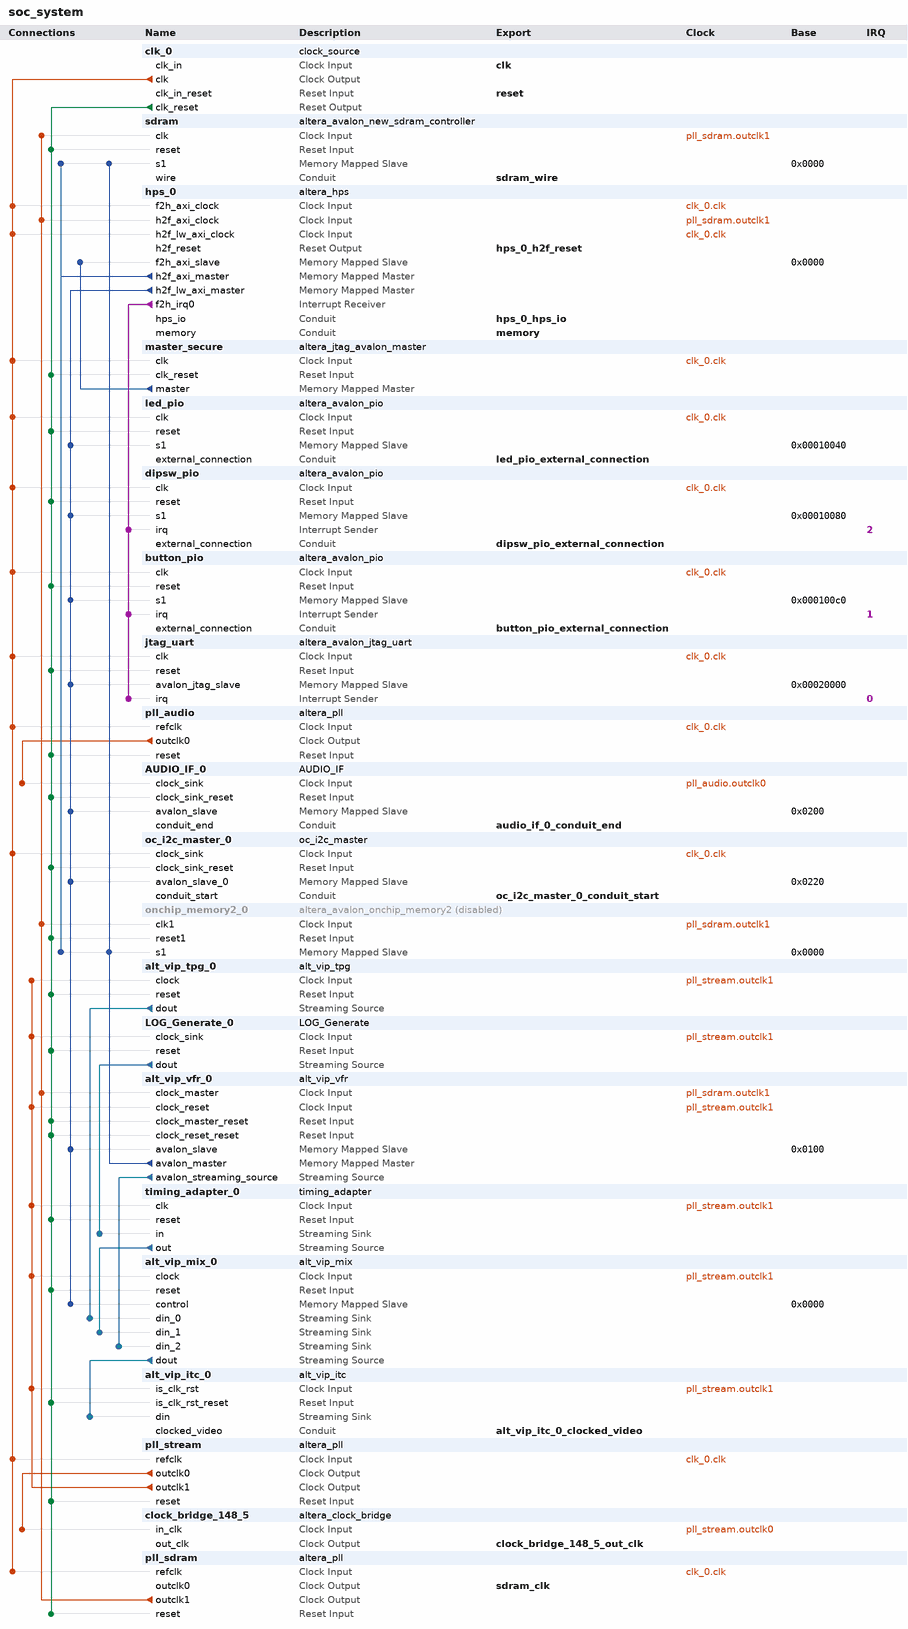
[diagram p0: system contents]
# Platform Designer (Qsys) system soc_system, Cyclone V 5CSXFC6D6F31C8ES
# Parameters at their usual value, and those the tool derives, are not listed.
package require -exact qsys 13.0
create_system soc_system
set_project_property DEVICE_FAMILY {Cyclone V}
set_project_property DEVICE 5CSXFC6D6F31C8ES

add_instance clk_0 clock_source 13.0
set_instance_parameter_value clk_0 clockFrequency 50000000

add_instance sdram altera_avalon_new_sdram_controller 13.0.1.99.2
set_instance_parameter_value sdram TAC 5.5
set_instance_parameter_value sdram TRCD 20.0
set_instance_parameter_value sdram TRP 20.0
set_instance_parameter_value sdram casLatency 3
set_instance_parameter_value sdram columnWidth 10
set_instance_parameter_value sdram dataWidth 16
set_instance_parameter_value sdram generateSimulationModel false
set_instance_parameter_value sdram model single_Micron_MT48LC4M32B2_7_chip
set_instance_parameter_value sdram numberOfBanks 4
set_instance_parameter_value sdram numberOfChipSelects 1
set_instance_parameter_value sdram powerUpDelay 100.0
set_instance_parameter_value sdram refreshPeriod 15.625
set_instance_parameter_value sdram rowWidth 13

add_instance hps_0 altera_hps 13.0.1
set_instance_parameter_value hps_0 MEM_VENDOR JEDEC
set_instance_parameter_value hps_0 MEM_ROW_ADDR_WIDTH 15
set_instance_parameter_value hps_0 MEM_COL_ADDR_WIDTH 10
set_instance_parameter_value hps_0 MEM_DQ_WIDTH 32
set_instance_parameter_value hps_0 MEM_BANKADDR_WIDTH 3
set_instance_parameter_value hps_0 MEM_DRV_STR RZQ/7
set_instance_parameter_value hps_0 MEM_RTT_NOM RZQ/4
set_instance_parameter_value hps_0 MEM_RTT_WR RZQ/4
set_instance_parameter_value hps_0 MEM_WTCL 8
set_instance_parameter_value hps_0 MEM_TCL 11
set_instance_parameter_value hps_0 TIMING_TIS 180
set_instance_parameter_value hps_0 TIMING_TIH 140
set_instance_parameter_value hps_0 TIMING_TDS 30
set_instance_parameter_value hps_0 TIMING_TDH 65
set_instance_parameter_value hps_0 TIMING_TDQSQ 125
set_instance_parameter_value hps_0 TIMING_TDQSCK 255
set_instance_parameter_value hps_0 TIMING_TQSH 0.4
set_instance_parameter_value hps_0 MEM_TRAS_NS 35.0
set_instance_parameter_value hps_0 MEM_TRCD_NS 13.75
set_instance_parameter_value hps_0 MEM_TRP_NS 13.75
set_instance_parameter_value hps_0 MEM_TRFC_NS 260.0
set_instance_parameter_value hps_0 MEM_TFAW_NS 30.0
set_instance_parameter_value hps_0 REF_CLK_FREQ 25.0
set_instance_parameter_value hps_0 DEFAULT_FAST_SIM_MODEL true
set_instance_parameter_value hps_0 TIMING_BOARD_MAX_CK_DELAY 0.03
set_instance_parameter_value hps_0 TIMING_BOARD_MAX_DQS_DELAY 0.02
set_instance_parameter_value hps_0 TIMING_BOARD_SKEW_CKDQS_DIMM_MIN 0.09
set_instance_parameter_value hps_0 TIMING_BOARD_SKEW_CKDQS_DIMM_MAX 0.16
set_instance_parameter_value hps_0 TIMING_BOARD_SKEW_WITHIN_DQS 0.01
set_instance_parameter_value hps_0 TIMING_BOARD_SKEW_BETWEEN_DQS 0.08
set_instance_parameter_value hps_0 TIMING_BOARD_DQ_TO_DQS_SKEW 0.0
set_instance_parameter_value hps_0 TIMING_BOARD_AC_SKEW 0.03
set_instance_parameter_value hps_0 TIMING_BOARD_AC_TO_CK_SKEW 0.0
set_instance_parameter_value hps_0 MEM_CLK_FREQ 400.0
set_instance_parameter_value hps_0 HPS_PROTOCOL DDR3
set_instance_parameter_value hps_0 STM_Enable false
set_instance_parameter_value hps_0 F2S_Width 2
set_instance_parameter_value hps_0 S2F_Width 3
set_instance_parameter_value hps_0 LWH2F_Enable true
set_instance_parameter_value hps_0 F2SCLK_DBGRST_Enable false
set_instance_parameter_value hps_0 F2SCLK_WARMRST_Enable false
set_instance_parameter_value hps_0 F2SCLK_COLDRST_Enable false
set_instance_parameter_value hps_0 F2SINTERRUPT_Enable true
set_instance_parameter_value hps_0 EMAC1_PinMuxing {HPS I/O Set 0}
set_instance_parameter_value hps_0 EMAC1_Mode RGMII
set_instance_parameter_value hps_0 QSPI_PinMuxing {HPS I/O Set 0}
set_instance_parameter_value hps_0 QSPI_Mode {1 SS}
set_instance_parameter_value hps_0 SDIO_PinMuxing {HPS I/O Set 0}
set_instance_parameter_value hps_0 SDIO_Mode {4-bit Data}
set_instance_parameter_value hps_0 USB1_PinMuxing {HPS I/O Set 0}
set_instance_parameter_value hps_0 USB1_Mode SDR
set_instance_parameter_value hps_0 SPIM1_PinMuxing {HPS I/O Set 0}
set_instance_parameter_value hps_0 SPIM1_Mode {Single Slave Select}
set_instance_parameter_value hps_0 UART0_PinMuxing {HPS I/O Set 0}
set_instance_parameter_value hps_0 UART0_Mode {No Flow Control}
set_instance_parameter_value hps_0 I2C0_PinMuxing {HPS I/O Set 0}
set_instance_parameter_value hps_0 I2C0_Mode I2C
set_instance_parameter_value hps_0 I2C1_PinMuxing {HPS I/O Set 0}
set_instance_parameter_value hps_0 I2C1_Mode I2C
set_instance_parameter_value hps_0 S2FCLK_USER1CLK_FREQ 100
set_instance_parameter_value hps_0 FPGA_PERIPHERAL_OUTPUT_CLOCK_FREQ_EMAC0_MD_CLK 100
set_instance_parameter_value hps_0 FPGA_PERIPHERAL_OUTPUT_CLOCK_FREQ_EMAC0_GTX_CLK 100
set_instance_parameter_value hps_0 FPGA_PERIPHERAL_OUTPUT_CLOCK_FREQ_EMAC1_MD_CLK 100
set_instance_parameter_value hps_0 FPGA_PERIPHERAL_OUTPUT_CLOCK_FREQ_EMAC1_GTX_CLK 100
set_instance_parameter_value hps_0 quartus_ini_hps_ip_enable_loanio false

add_instance master_secure altera_jtag_avalon_master 13.0

add_instance led_pio altera_avalon_pio 13.0.1.99.2
set_instance_parameter_value led_pio direction Output
set_instance_parameter_value led_pio resetValue 15
set_instance_parameter_value led_pio width 10

add_instance dipsw_pio altera_avalon_pio 13.0.1.99.2
set_instance_parameter_value dipsw_pio bitClearingEdgeCapReg true
set_instance_parameter_value dipsw_pio captureEdge true
set_instance_parameter_value dipsw_pio direction Input
set_instance_parameter_value dipsw_pio edgeType ANY
set_instance_parameter_value dipsw_pio generateIRQ true
set_instance_parameter_value dipsw_pio irqType EDGE
set_instance_parameter_value dipsw_pio width 4

add_instance button_pio altera_avalon_pio 13.0.1.99.2
set_instance_parameter_value button_pio bitClearingEdgeCapReg true
set_instance_parameter_value button_pio captureEdge true
set_instance_parameter_value button_pio direction Input
set_instance_parameter_value button_pio edgeType FALLING
set_instance_parameter_value button_pio generateIRQ true
set_instance_parameter_value button_pio irqType EDGE
set_instance_parameter_value button_pio width 2

add_instance jtag_uart altera_avalon_jtag_uart 13.0.1.99.2
set_instance_parameter_value jtag_uart allowMultipleConnections true
set_instance_parameter_value jtag_uart simInteractiveOptions INTERACTIVE_ASCII_OUTPUT

add_instance pll_audio altera_pll 13.0
set_instance_parameter_value pll_audio gui_device_speed_grade 8
set_instance_parameter_value pll_audio gui_pll_mode {Fractional-N PLL}
set_instance_parameter_value pll_audio gui_reference_clock_frequency 50.0
set_instance_parameter_value pll_audio gui_operation_mode normal
set_instance_parameter_value pll_audio gui_use_locked true
set_instance_parameter_value pll_audio gui_number_of_clocks 1
set_instance_parameter_value pll_audio gui_output_clock_frequency0 18.431999

add_instance AUDIO_IF_0 AUDIO_IF 1.0

add_instance oc_i2c_master_0 oc_i2c_master 1.0

add_instance onchip_memory2_0 altera_avalon_onchip_memory2 13.0.1.99.2
set_instance_property onchip_memory2_0 ENABLED false
set_instance_parameter_value onchip_memory2_0 dataWidth 32
set_instance_parameter_value onchip_memory2_0 dualPort false
set_instance_parameter_value onchip_memory2_0 initMemContent true
set_instance_parameter_value onchip_memory2_0 initializationFileName onchip_mem.hex
set_instance_parameter_value onchip_memory2_0 memorySize 307200

add_instance alt_vip_tpg_0 alt_vip_tpg 13.0
set_instance_parameter_value alt_vip_tpg_0 CHANNELS_IN_PAR 3
set_instance_parameter_value alt_vip_tpg_0 CTRL_INTERFACE_DEPTH 10
set_instance_parameter_value alt_vip_tpg_0 PARAMETERISATION {<testPatternGeneratorParams><TPG_NAME>MyPatternGenerator</TPG_NAME><TPG_RUNTIME_CONTROL>0</TPG_RUNTIME_CONTROL><TPG_BPS>8</TPG_BPS><TPG_MAX_WIDTH>1280</TPG_MAX_WIDTH><TPG_MAX_HEIGHT>1024</TPG_MAX_HEIGHT><TPG_COLORSPACE>COLORSPACE_RGB</TPG_COLORSPACE><TPG_FORMAT>SAMPLE_444</TPG_FORMAT><TPG_INTERLACE>PROGRESSIVE_FRAMES</TPG_INTERLACE><TPG_PARALLEL_MODE>true</TPG_PARALLEL_MODE><TPG_PATTERN>TPG_PATTERN_UNIFORM</TPG_PATTERN><TPG_UNIFORM_VAL_C1>0</TPG_UNIFORM_VAL_C1><TPG_UNIFORM_VAL_C2>0</TPG_UNIFORM_VAL_C2><TPG_UNIFORM_VAL_C3>0</TPG_UNIFORM_VAL_C3></testPatternGeneratorParams>}

add_instance LOG_Generate_0 LOG_Generate 1.0
set_instance_parameter_value LOG_Generate_0 BACK_COLOR 1
set_instance_parameter_value LOG_Generate_0 FRONT_COLOR 16777215
set_instance_parameter_value LOG_Generate_0 MIF_FILE_LOCATION ./log.mif
set_instance_parameter_value LOG_Generate_0 LOG_WIDTH 1024
set_instance_parameter_value LOG_Generate_0 LOG_HEIGHT 249

add_instance alt_vip_vfr_0 alt_vip_vfr 13.0
set_instance_parameter_value alt_vip_vfr_0 NUMBER_OF_CHANNELS_IN_PARALLEL 3
set_instance_parameter_value alt_vip_vfr_0 MAX_IMAGE_WIDTH 640
set_instance_parameter_value alt_vip_vfr_0 MAX_IMAGE_HEIGHT 480
set_instance_parameter_value alt_vip_vfr_0 MEM_PORT_WIDTH 32
set_instance_parameter_value alt_vip_vfr_0 RMASTER_FIFO_DEPTH 1024
set_instance_parameter_value alt_vip_vfr_0 RMASTER_BURST_TARGET 64

add_instance timing_adapter_0 timing_adapter 13.0
set_instance_parameter_value timing_adapter_0 inBitsPerSymbol 8
set_instance_parameter_value timing_adapter_0 inChannelWidth 0
set_instance_parameter_value timing_adapter_0 inErrorWidth 0
set_instance_parameter_value timing_adapter_0 inMaxChannel 0
set_instance_parameter_value timing_adapter_0 inReadyLatency 0
set_instance_parameter_value timing_adapter_0 inSymbolsPerBeat 3
set_instance_parameter_value timing_adapter_0 inUseEmptyPort NO
set_instance_parameter_value timing_adapter_0 inUsePackets true
set_instance_parameter_value timing_adapter_0 inUseReady true
set_instance_parameter_value timing_adapter_0 inUseValid true
set_instance_parameter_value timing_adapter_0 outReadyLatency 1
set_instance_parameter_value timing_adapter_0 outUseReady true
set_instance_parameter_value timing_adapter_0 outUseValid true

add_instance alt_vip_mix_0 alt_vip_mix 13.0
set_instance_parameter_value alt_vip_mix_0 PARAMETERISATION {<mixerParams><MIX_NAME>mixer</MIX_NAME><MIX_ALPHA_ENABLED>false</MIX_ALPHA_ENABLED><MIX_ALPHA_BPS>8</MIX_ALPHA_BPS><MIX_CHANNELS_IN_SEQ>1</MIX_CHANNELS_IN_SEQ><MIX_CHANNELS_IN_PAR>3</MIX_CHANNELS_IN_PAR><MIX_BPS>8</MIX_BPS><MIX_NUM_LAYERS>3</MIX_NUM_LAYERS><MIX_RUNTIME_MAX_WIDTH>1280</MIX_RUNTIME_MAX_WIDTH><MIX_RUNTIME_MAX_HEIGHT>1024</MIX_RUNTIME_MAX_HEIGHT></mixerParams>}

add_instance alt_vip_itc_0 alt_vip_itc 13.0
set_instance_parameter_value alt_vip_itc_0 NUMBER_OF_COLOUR_PLANES 3
set_instance_parameter_value alt_vip_itc_0 H_ACTIVE_PIXELS 1280
set_instance_parameter_value alt_vip_itc_0 V_ACTIVE_LINES 1024
set_instance_parameter_value alt_vip_itc_0 FIFO_DEPTH 1280
set_instance_parameter_value alt_vip_itc_0 THRESHOLD 1279
set_instance_parameter_value alt_vip_itc_0 H_SYNC_LENGTH 112
set_instance_parameter_value alt_vip_itc_0 H_FRONT_PORCH 48
set_instance_parameter_value alt_vip_itc_0 H_BACK_PORCH 248
set_instance_parameter_value alt_vip_itc_0 V_SYNC_LENGTH 3
set_instance_parameter_value alt_vip_itc_0 V_FRONT_PORCH 1
set_instance_parameter_value alt_vip_itc_0 V_BACK_PORCH 38

add_instance pll_stream altera_pll 13.0
set_instance_parameter_value pll_stream gui_device_speed_grade 8
set_instance_parameter_value pll_stream gui_pll_mode {Integer-N PLL}
set_instance_parameter_value pll_stream gui_reference_clock_frequency 50.0
set_instance_parameter_value pll_stream gui_operation_mode normal
set_instance_parameter_value pll_stream gui_use_locked true
set_instance_parameter_value pll_stream gui_number_of_clocks 2
set_instance_parameter_value pll_stream gui_output_clock_frequency0 108.0
set_instance_parameter_value pll_stream gui_actual_phase_shift0 {-78 ps}
set_instance_parameter_value pll_stream gui_output_clock_frequency1 150.0
set_instance_parameter_value pll_stream gui_actual_output_clock_frequency1 {197.999999 MHz}
set_instance_parameter_value pll_stream gui_phase_shift_deg1 0

add_instance clock_bridge_148_5 altera_clock_bridge 13.0
set_instance_parameter_value clock_bridge_148_5 DERIVED_CLOCK_RATE 108000000
set_instance_parameter_value clock_bridge_148_5 EXPLICIT_CLOCK_RATE 0

add_instance pll_sdram altera_pll 13.0
set_instance_parameter_value pll_sdram gui_device_speed_grade 8
set_instance_parameter_value pll_sdram gui_pll_mode {Integer-N PLL}
set_instance_parameter_value pll_sdram gui_reference_clock_frequency 50.0
set_instance_parameter_value pll_sdram gui_operation_mode normal
set_instance_parameter_value pll_sdram gui_use_locked true
set_instance_parameter_value pll_sdram gui_number_of_clocks 2
set_instance_parameter_value pll_sdram gui_output_clock_frequency0 120.0
set_instance_parameter_value pll_sdram gui_ps_units0 degrees
set_instance_parameter_value pll_sdram gui_actual_phase_shift0 {280 deg}
set_instance_parameter_value pll_sdram gui_output_clock_frequency1 120.0
set_instance_parameter_value pll_sdram gui_phase_shift_deg1 0

# connections
add_connection clk_0.clk button_pio.clk clock
add_connection clk_0.clk dipsw_pio.clk clock
add_connection clk_0.clk hps_0.f2h_axi_clock clock
add_connection clk_0.clk hps_0.h2f_lw_axi_clock clock
add_connection clk_0.clk jtag_uart.clk clock
add_connection clk_0.clk led_pio.clk clock
add_connection clk_0.clk master_secure.clk clock
add_connection clk_0.clk oc_i2c_master_0.clock_sink clock
add_connection clk_0.clk pll_audio.refclk clock
add_connection clk_0.clk pll_sdram.refclk clock
add_connection clk_0.clk pll_stream.refclk clock
add_connection pll_audio.outclk0 AUDIO_IF_0.clock_sink clock
add_connection pll_sdram.outclk1 alt_vip_vfr_0.clock_master clock
add_connection pll_sdram.outclk1 hps_0.h2f_axi_clock clock
add_connection pll_sdram.outclk1 onchip_memory2_0.clk1 clock
add_connection pll_sdram.outclk1 sdram.clk clock
add_connection pll_stream.outclk0 clock_bridge_148_5.in_clk clock
add_connection pll_stream.outclk1 alt_vip_itc_0.is_clk_rst clock
add_connection pll_stream.outclk1 alt_vip_mix_0.clock clock
add_connection pll_stream.outclk1 alt_vip_tpg_0.clock clock
add_connection pll_stream.outclk1 alt_vip_vfr_0.clock_reset clock
add_connection pll_stream.outclk1 LOG_Generate_0.clock_sink clock
add_connection pll_stream.outclk1 timing_adapter_0.clk clock
add_connection clk_0.clk_reset alt_vip_itc_0.is_clk_rst_reset reset
add_connection clk_0.clk_reset alt_vip_mix_0.reset reset
add_connection clk_0.clk_reset alt_vip_tpg_0.reset reset
add_connection clk_0.clk_reset alt_vip_vfr_0.clock_master_reset reset
add_connection clk_0.clk_reset alt_vip_vfr_0.clock_reset_reset reset
add_connection clk_0.clk_reset AUDIO_IF_0.clock_sink_reset reset
add_connection clk_0.clk_reset button_pio.reset reset
add_connection clk_0.clk_reset dipsw_pio.reset reset
add_connection clk_0.clk_reset jtag_uart.reset reset
add_connection clk_0.clk_reset led_pio.reset reset
add_connection clk_0.clk_reset LOG_Generate_0.reset reset
add_connection clk_0.clk_reset master_secure.clk_reset reset
add_connection clk_0.clk_reset oc_i2c_master_0.clock_sink_reset reset
add_connection clk_0.clk_reset onchip_memory2_0.reset1 reset
add_connection clk_0.clk_reset pll_audio.reset reset
add_connection clk_0.clk_reset pll_sdram.reset reset
add_connection clk_0.clk_reset pll_stream.reset reset
add_connection clk_0.clk_reset sdram.reset reset
add_connection clk_0.clk_reset timing_adapter_0.reset reset
add_connection alt_vip_vfr_0.avalon_master onchip_memory2_0.s1 avalon
set_connection_parameter_value alt_vip_vfr_0.avalon_master/onchip_memory2_0.s1 arbitrationPriority 2
set_connection_parameter_value alt_vip_vfr_0.avalon_master/onchip_memory2_0.s1 baseAddress 0x0000
add_connection alt_vip_vfr_0.avalon_master sdram.s1 avalon
set_connection_parameter_value alt_vip_vfr_0.avalon_master/sdram.s1 arbitrationPriority 3
set_connection_parameter_value alt_vip_vfr_0.avalon_master/sdram.s1 baseAddress 0x0000
add_connection hps_0.h2f_axi_master onchip_memory2_0.s1 avalon
set_connection_parameter_value hps_0.h2f_axi_master/onchip_memory2_0.s1 baseAddress 0x0000
add_connection hps_0.h2f_axi_master sdram.s1 avalon
set_connection_parameter_value hps_0.h2f_axi_master/sdram.s1 arbitrationPriority 10
set_connection_parameter_value hps_0.h2f_axi_master/sdram.s1 baseAddress 0x0000
add_connection hps_0.h2f_lw_axi_master alt_vip_mix_0.control avalon
set_connection_parameter_value hps_0.h2f_lw_axi_master/alt_vip_mix_0.control baseAddress 0x0000
add_connection hps_0.h2f_lw_axi_master alt_vip_vfr_0.avalon_slave avalon
set_connection_parameter_value hps_0.h2f_lw_axi_master/alt_vip_vfr_0.avalon_slave baseAddress 0x0100
add_connection hps_0.h2f_lw_axi_master AUDIO_IF_0.avalon_slave avalon
set_connection_parameter_value hps_0.h2f_lw_axi_master/AUDIO_IF_0.avalon_slave baseAddress 0x0200
add_connection hps_0.h2f_lw_axi_master button_pio.s1 avalon
set_connection_parameter_value hps_0.h2f_lw_axi_master/button_pio.s1 baseAddress 0x000100c0
add_connection hps_0.h2f_lw_axi_master dipsw_pio.s1 avalon
set_connection_parameter_value hps_0.h2f_lw_axi_master/dipsw_pio.s1 baseAddress 0x00010080
add_connection hps_0.h2f_lw_axi_master jtag_uart.avalon_jtag_slave avalon
set_connection_parameter_value hps_0.h2f_lw_axi_master/jtag_uart.avalon_jtag_slave baseAddress 0x00020000
add_connection hps_0.h2f_lw_axi_master led_pio.s1 avalon
set_connection_parameter_value hps_0.h2f_lw_axi_master/led_pio.s1 baseAddress 0x00010040
add_connection hps_0.h2f_lw_axi_master oc_i2c_master_0.avalon_slave_0 avalon
set_connection_parameter_value hps_0.h2f_lw_axi_master/oc_i2c_master_0.avalon_slave_0 baseAddress 0x0220
add_connection master_secure.master hps_0.f2h_axi_slave avalon
set_connection_parameter_value master_secure.master/hps_0.f2h_axi_slave baseAddress 0x0000
add_connection alt_vip_mix_0.dout alt_vip_itc_0.din avalon_streaming
add_connection alt_vip_tpg_0.dout alt_vip_mix_0.din_0 avalon_streaming
add_connection alt_vip_vfr_0.avalon_streaming_source alt_vip_mix_0.din_2 avalon_streaming
add_connection LOG_Generate_0.dout timing_adapter_0.in avalon_streaming
add_connection timing_adapter_0.out alt_vip_mix_0.din_1 avalon_streaming
add_connection hps_0.f2h_irq0 button_pio.irq interrupt
set_connection_parameter_value hps_0.f2h_irq0/button_pio.irq irqNumber 1
add_connection hps_0.f2h_irq0 dipsw_pio.irq interrupt
set_connection_parameter_value hps_0.f2h_irq0/dipsw_pio.irq irqNumber 2
add_connection hps_0.f2h_irq0 jtag_uart.irq interrupt
set_connection_parameter_value hps_0.f2h_irq0/jtag_uart.irq irqNumber 0

# exported interfaces
add_interface reset reset sink
set_interface_property reset EXPORT_OF clk_0.clk_in_reset
add_interface memory conduit end
set_interface_property memory EXPORT_OF hps_0.memory
add_interface hps_0_hps_io conduit end
set_interface_property hps_0_hps_io EXPORT_OF hps_0.hps_io
add_interface led_pio_external_connection conduit end
set_interface_property led_pio_external_connection EXPORT_OF led_pio.external_connection
add_interface dipsw_pio_external_connection conduit end
set_interface_property dipsw_pio_external_connection EXPORT_OF dipsw_pio.external_connection
add_interface button_pio_external_connection conduit end
set_interface_property button_pio_external_connection EXPORT_OF button_pio.external_connection
add_interface hps_0_h2f_reset reset source
set_interface_property hps_0_h2f_reset EXPORT_OF hps_0.h2f_reset
add_interface oc_i2c_master_0_conduit_start conduit end
set_interface_property oc_i2c_master_0_conduit_start EXPORT_OF oc_i2c_master_0.conduit_start
add_interface clock_bridge_148_5_out_clk clock source
set_interface_property clock_bridge_148_5_out_clk EXPORT_OF clock_bridge_148_5.out_clk
add_interface sdram_clk clock source
set_interface_property sdram_clk EXPORT_OF pll_sdram.outclk0
add_interface sdram_wire conduit end
set_interface_property sdram_wire EXPORT_OF sdram.wire
add_interface alt_vip_itc_0_clocked_video conduit end
set_interface_property alt_vip_itc_0_clocked_video EXPORT_OF alt_vip_itc_0.clocked_video
add_interface clk clock sink
set_interface_property clk EXPORT_OF clk_0.clk_in
add_interface audio_if_0_conduit_end conduit end
set_interface_property audio_if_0_conduit_end EXPORT_OF AUDIO_IF_0.conduit_end

set_interconnect_requirement {$system} qsys_mm.clockCrossingAdapter HANDSHAKE
set_interconnect_requirement {$system} qsys_mm.maxAdditionalLatency 1

save_system soc_system.qsys
